# Altium schematic sheet PROGRAMMER.SchDoc
size A; SheetNumber: 3; SheetTotal: 5
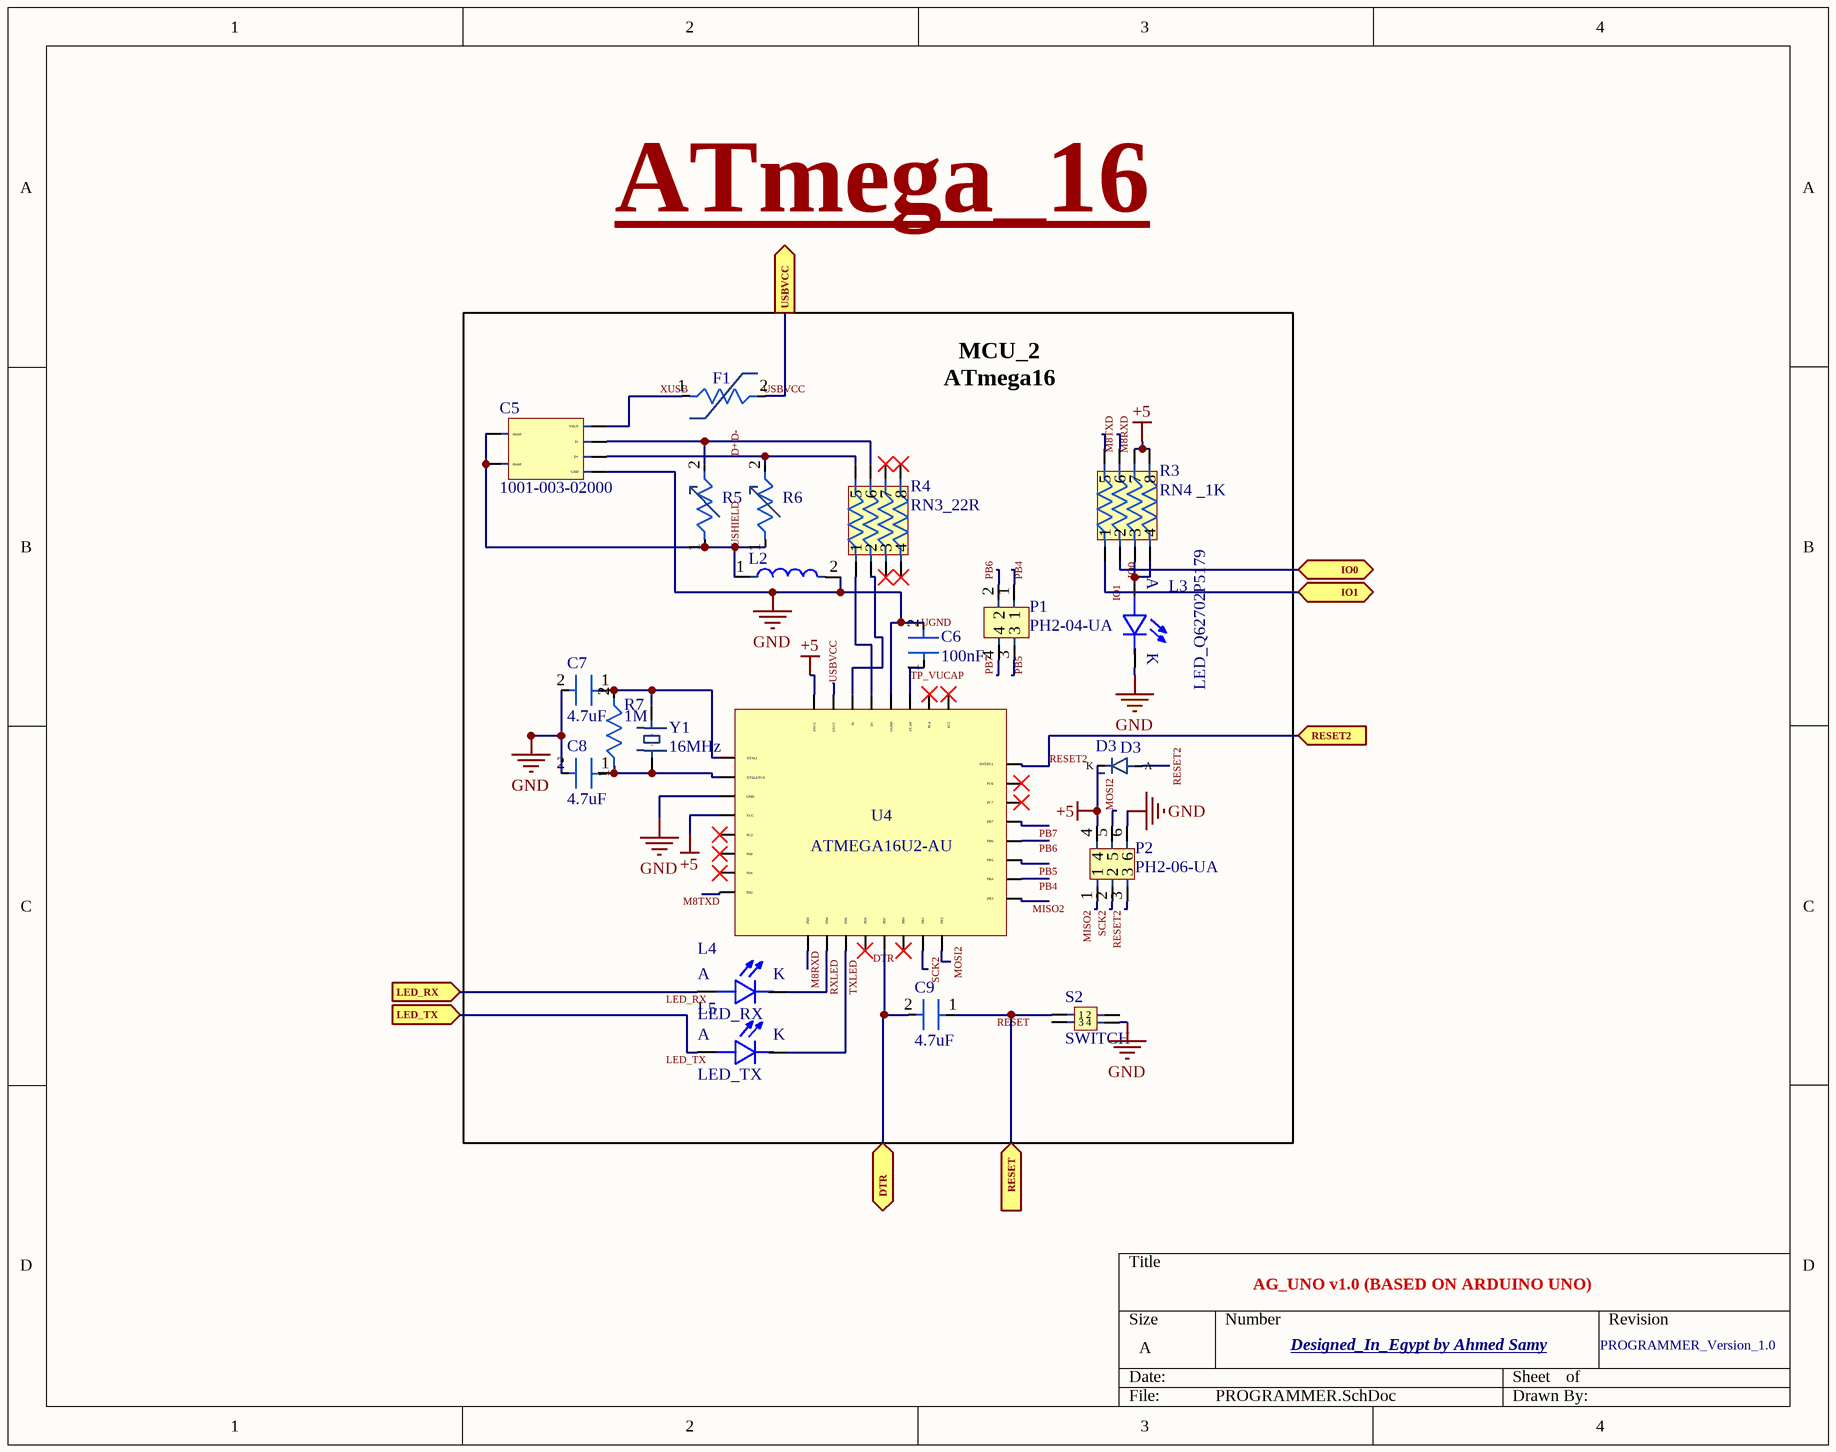
[diagram p0: PROGRAMMER.SchDoc]

## Parts
C5  1001-003-02000  [1001-003-02000]
C6  100nF  [80-C0805C104M3R]
C7  4.7uF  [3372-0805W475K500CCTR-ND]
C8  4.7uF  [3372-0805W475K500CCTR-ND]
C9  4.7uF  [3372-0805W475K500CCTR-ND]
D3  D3  [CD1206-S01575]
F1  MF-MSMF050-2  [MF-MSMF050-2]  (value not drawn)
L2  BLM21PG300SN1D  [BLM21PG300SN1D]  (value not drawn)
L3  LED_Q62702P5179  [LED_Q62702P5179]
L4  LED_RX  [LED_Q62702P5179]
L5  LED_TX  [LED_Q62702P5179]
P1  PH2-04-UA  [PH2-04-UA]
P2  PH2-06-UA  [PH2-06-UA]
R3  RN4 _1K  [CAY16-103J4GLF]
R4  RN3_22R  [CAY16-103J4GLF]
R5  CG0603MLC-05E  [CG0603MLC-05E]  (value not drawn)
R6  CG0603MLC-05E  [CG0603MLC-05E]  (value not drawn)
R7  1M  [CRCW06031M00JNEAC]
S2  SWITCH  [B3SL-1002P]
U4  ATMEGA16U2-AU  [ATMEGA16U2-AU]
Y1  16MHz  [ECS-160-20-4X-DU]

## Ports
DTR (bidir), IO0 (bidir), IO1 (bidir), LED_RX (in), LED_TX (in), RESET2 (in), RESET (in), USBVCC (out)

## Nets
+5: D3.1(K) P2.4 R3.7 R3.8 U4.4(VCC) U4.32(AVCC)
UGND: C5.6(GND) C6.2 C7.2 C8.2 L2.2 L3.C P2.6 S2.4 U4.3(GND) U4.28(UGND)  [also labelled GND]
D+: C5.5(D+) R4.5 R6.2
D-: C5.4(D-) R4.6 R5.2
DTR: C9.2 U4.13(PD7) ; port DTR
IO0: R3.2 ; port IO0
IO1: R3.1 ; port IO1
LED_RX: L4.A ; port LED_RX
LED_TX: L5.A ; port LED_TX
M8RXD: R3.6 U4.9(PD3)
M8TXD: R3.5 U4.8(PD2)
MISO2: P2.1 U4.17(PB3)
MOSI2: P2.5 U4.16(PB2)
PB4: P1.1 U4.18(PB4)
PB5: P1.3 U4.19(PB5)
PB6: P1.2 U4.20(PB6)
PB7: P1.4 U4.21(PB7)
RESET: C9.1 S2.1 ; port RESET
RESET2: D3.2(A) P2.3 U4.24(RST/PC1) ; port RESET2
RXLED: L4.C U4.10(PD4)
SCK2: P2.2 U4.15(PB1)
TP_VUCAP: C6.1 U4.27(UCAP)
TXLED: L5.C U4.11(PD5)
USBVCC: F1.2 U4.31(UVCC) ; port USBVCC
USHIELD: C5.1(shield) C5.2(shield) L2.1 R5.1 R6.1
XUSB: C5.3(VBUS) F1.1
NetC7_1: C7.1 R7.2 U4.1(XTAL1) Y1.1
NetC8_1: C8.1 R7.1 U4.2(XTAL2/PC0) Y1.2
NetL3_A: L3.A R3.3 R3.4
NetR4_1: R4.1 U4.29(D+)
NetR4_2: R4.2 U4.30(D-)

Not connected (* = marked no-connect by the designer): R4 3* 4* 7* 8*; S2 2 3; U4 5(PC2)* 6(PD0)* 7(PD1)* 12(PD6)* 14(PB0)* 22(PC7)* 23(PC6)* 25(PC5)* 26(PC4)*

## Notes on the sheet
- ATmega_16
- MCU_2
  ATmega16
- AG_UNO v1.0 (BASED ON ARDUINO UNO)
- Designed_In_Egypt by Ahmed Samy
- PROGRAMMER_Version_1.0
- (in symbol LED_Q62702P5179) K

## Library data of the parts
C5 = 1001-003-02000: USB-B (USB TYPE-B) USB 1.1 Receptacle Connector 4 Position Through Hole, Right Angle
C6 = 80-C0805C104M3R: Multilayer Ceramic Capacitors MLCC - SMD/SMT NEW GLOBAL PN KAM21BR71H104KM 50V 0.1uF X7R 0805 10% AEC-Q200
C7-C9 = 3372-0805W475K500CCTR-ND: CAP.,SMD,0805,X5R,4.7UF,10%,50V
D3 = CD1206-S01575: Diode 100 V 150mA Surface Mount 1206 [D2 UNO]
F1 = MF-MSMF050-2: Polymeric PTC Resettable Fuse 15V 500 mA Ih Surface Mount 1812 (4532 Metric), Concave [UNO]
L2 = BLM21PG300SN1D: 30 Ohms @ 100 MHz 1 Power Line Ferrite Bead 0805 (2012 Metric) 4A 14mOhm
L3-L5 = LED_Q62702P5179: LED 0805
P1 = PH2-04-UA: Connector Header Through Hole 4 position 0.100" (2.54mm)
P2 = PH2-06-UA: Connector Header Through Hole 6 position 0.100" (2.54mm) [ICSP UNO]
R3 R4 = CAY16-103J4GLF: 10k Ohm ±5% 62.5mW Power Per Element Isolated 4 Resistor Network/Array ±200ppm/°C 1206 (3216 Metric), Convex, Long Side Terminals
R5 R6 = CG0603MLC-05E: Varistor 1 Circuit Surface Mount, MLCV 0603 (1608 Metric)
R7 = CRCW06031M00JNEAC: 1 MOhms ±5% 0.1W, 1/10W Chip Resistor 0603 (1608 Metric) Thick Film
S2 = B3SL-1002P: Tactile Switch SPST-NO Top Actuated Surface Mount
U4 = ATMEGA16U2-AU: AVR AVR® ATmega Microcontroller IC 8-Bit 16MHz 16KB (8K x 16) FLASH 32-TQFP (7x7)
Y1 = ECS-160-20-4X-DU: 16 MHz ±30ppm Crystal 20pF 40 Ohms HC-49/US